# EasyEDA Pro project Esquemático e Layout - Shield Display.eprj

# Schematic Schematic1
Board Name: Board1; Create Date: 2025-09-02; Page Name: P1; Project Name: ShieldDisplay; Schematic Name: Schematic1; Update Date: 2026-02-06; Page Size: A4; Version: V1.0
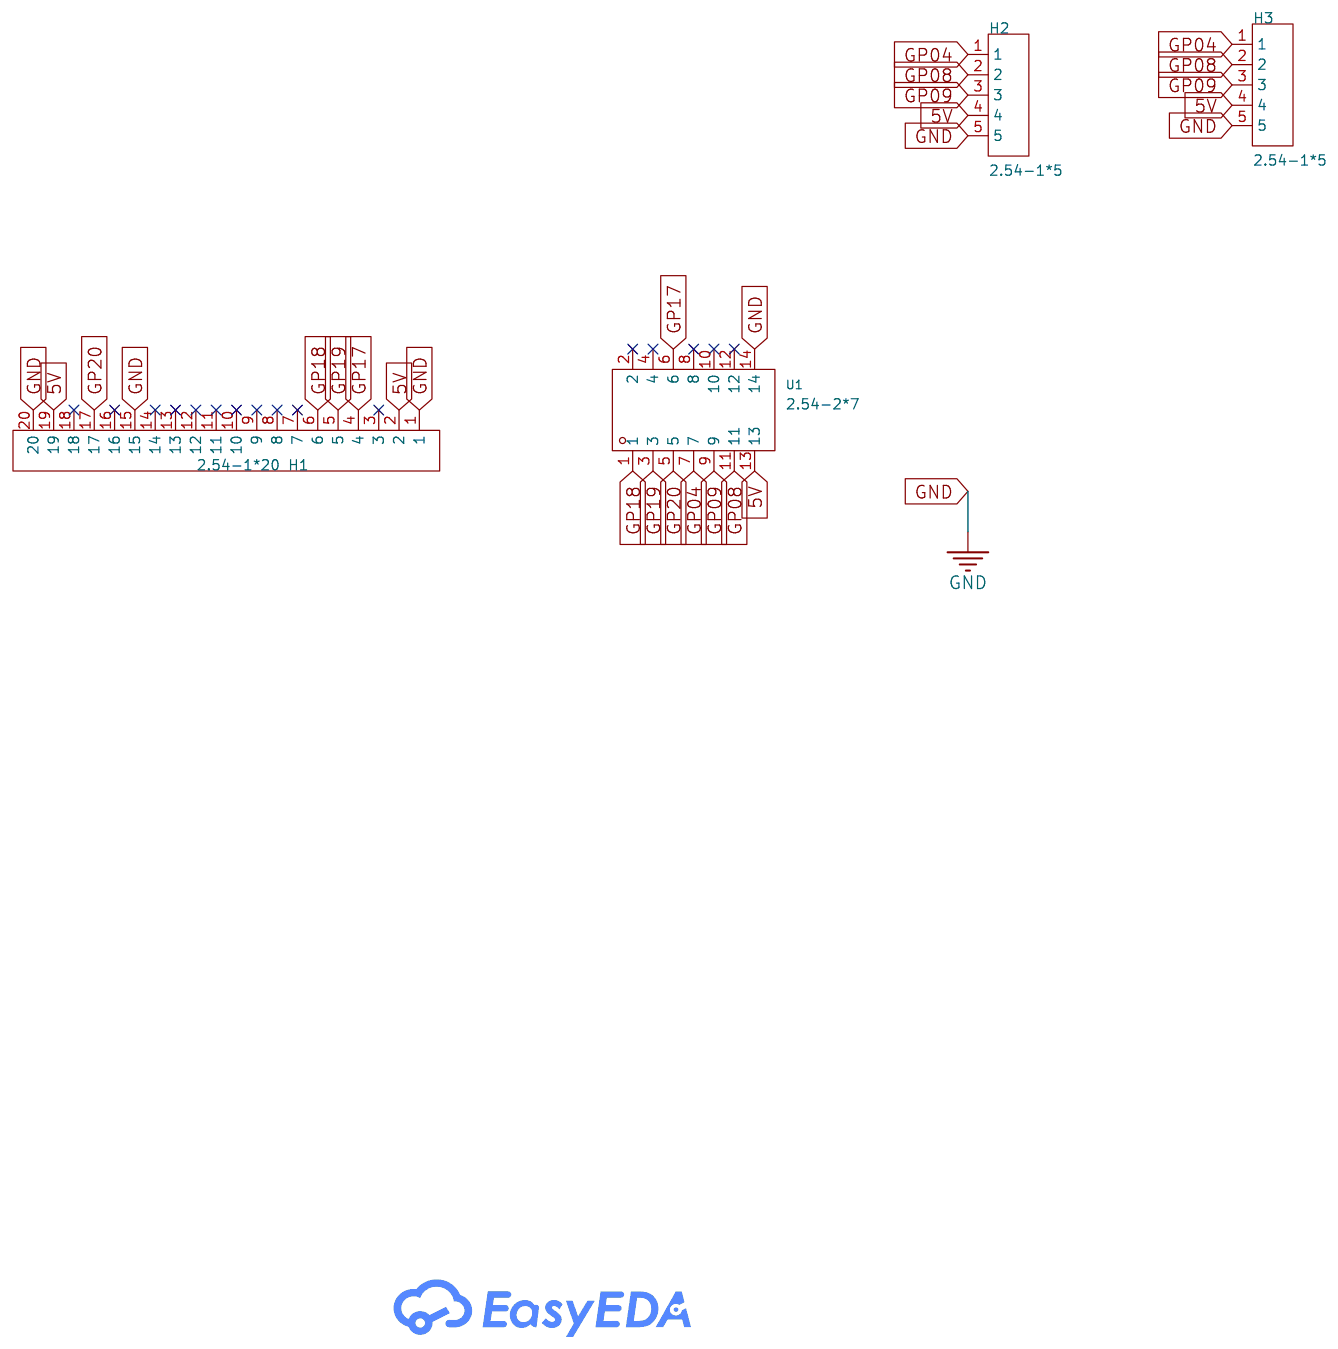
[diagram p0: schematic sheet]

## Parts
H1  2.54-1*20  [HDR-TH_20P-P2.54-V-M]
H2  2.54-1*5  [HDR-TH_5P-P2.54-V-M]
H3  2.54-1*5  [HDR-TH_5P-P2.54-V-M]
U1  2.54-2*7  [HDR-TH_14P-P2.54-V-F-R2-C7-S2.54]

## Library data of the parts
H1 = 2.54-1*20: Pin Structure:1x20P Pitch:2.54mm Number of Rows:1 Number of Pins:20P; Supplier Part: C5156618; Manufacturer: ZHOURI(洲日); Supplier Footprint: 插件,P=2.54mm; JLCPCB Part Class: Extended Part; Datasheet: https://item.szlcsc.com/datasheet/2.54-1*20/5790718.html; Supplier: LCSC; Pin Structure: 1x20P; Pitch: 2.54mm; Number of Rows: 1; Number of Pins: 20P
H2 H3 = 2.54-1*5: Pin Structure:1x5P Pitch:2.54mm Number of Rows:1 Number of Pins:5P; Supplier Part: C5156614; Manufacturer: ZHOURI(洲日); Supplier Footprint: 插件,P=2.54mm; JLCPCB Part Class: Extended Part; Datasheet: https://item.szlcsc.com/datasheet/2.54-1*5/5790714.html; Supplier: LCSC; Pin Structure: 1x5P; Pitch: 2.54mm; Number of Rows: 1; Number of Pins: 5P
U1 = 2.54-2*7: Pin Structure:2x7P Pitch:2.54mm Number of Rows:2 Number of Pins:14P; Supplier Part: C5116484; Manufacturer: ZHOURI(洲日); Supplier Footprint: 插件,P=2.54mm; JLCPCB Part Class: Extended Part; Datasheet: https://item.szlcsc.com/datasheet/2.54-2*7/5692727.html; Supplier: LCSC; Pin Structure: 2x7P; Pitch: 2.54mm; Number of Rows: 2; Number of Pins: 14P

## Nets
5V: H1.2 H1.19 H2.4 H3.4 U1.13
GND: H1.1 H1.15 H1.20 H2.5 H3.5 U1.14
GP04: H2.1 H3.1 U1.7
GP08: H2.2 H3.2 U1.11
GP09: H2.3 H3.3 U1.9
GP17: H1.4 U1.6
GP18: H1.6 U1.1
GP19: H1.5 U1.3
GP20: H1.17 U1.5

Not connected (* = marked no-connect by the designer): H1 3* 7* 8* 9* 10* 11* 12* 13* 14* 16* 18*; U1 2* 4* 8* 10* 12*

# Board PCB1
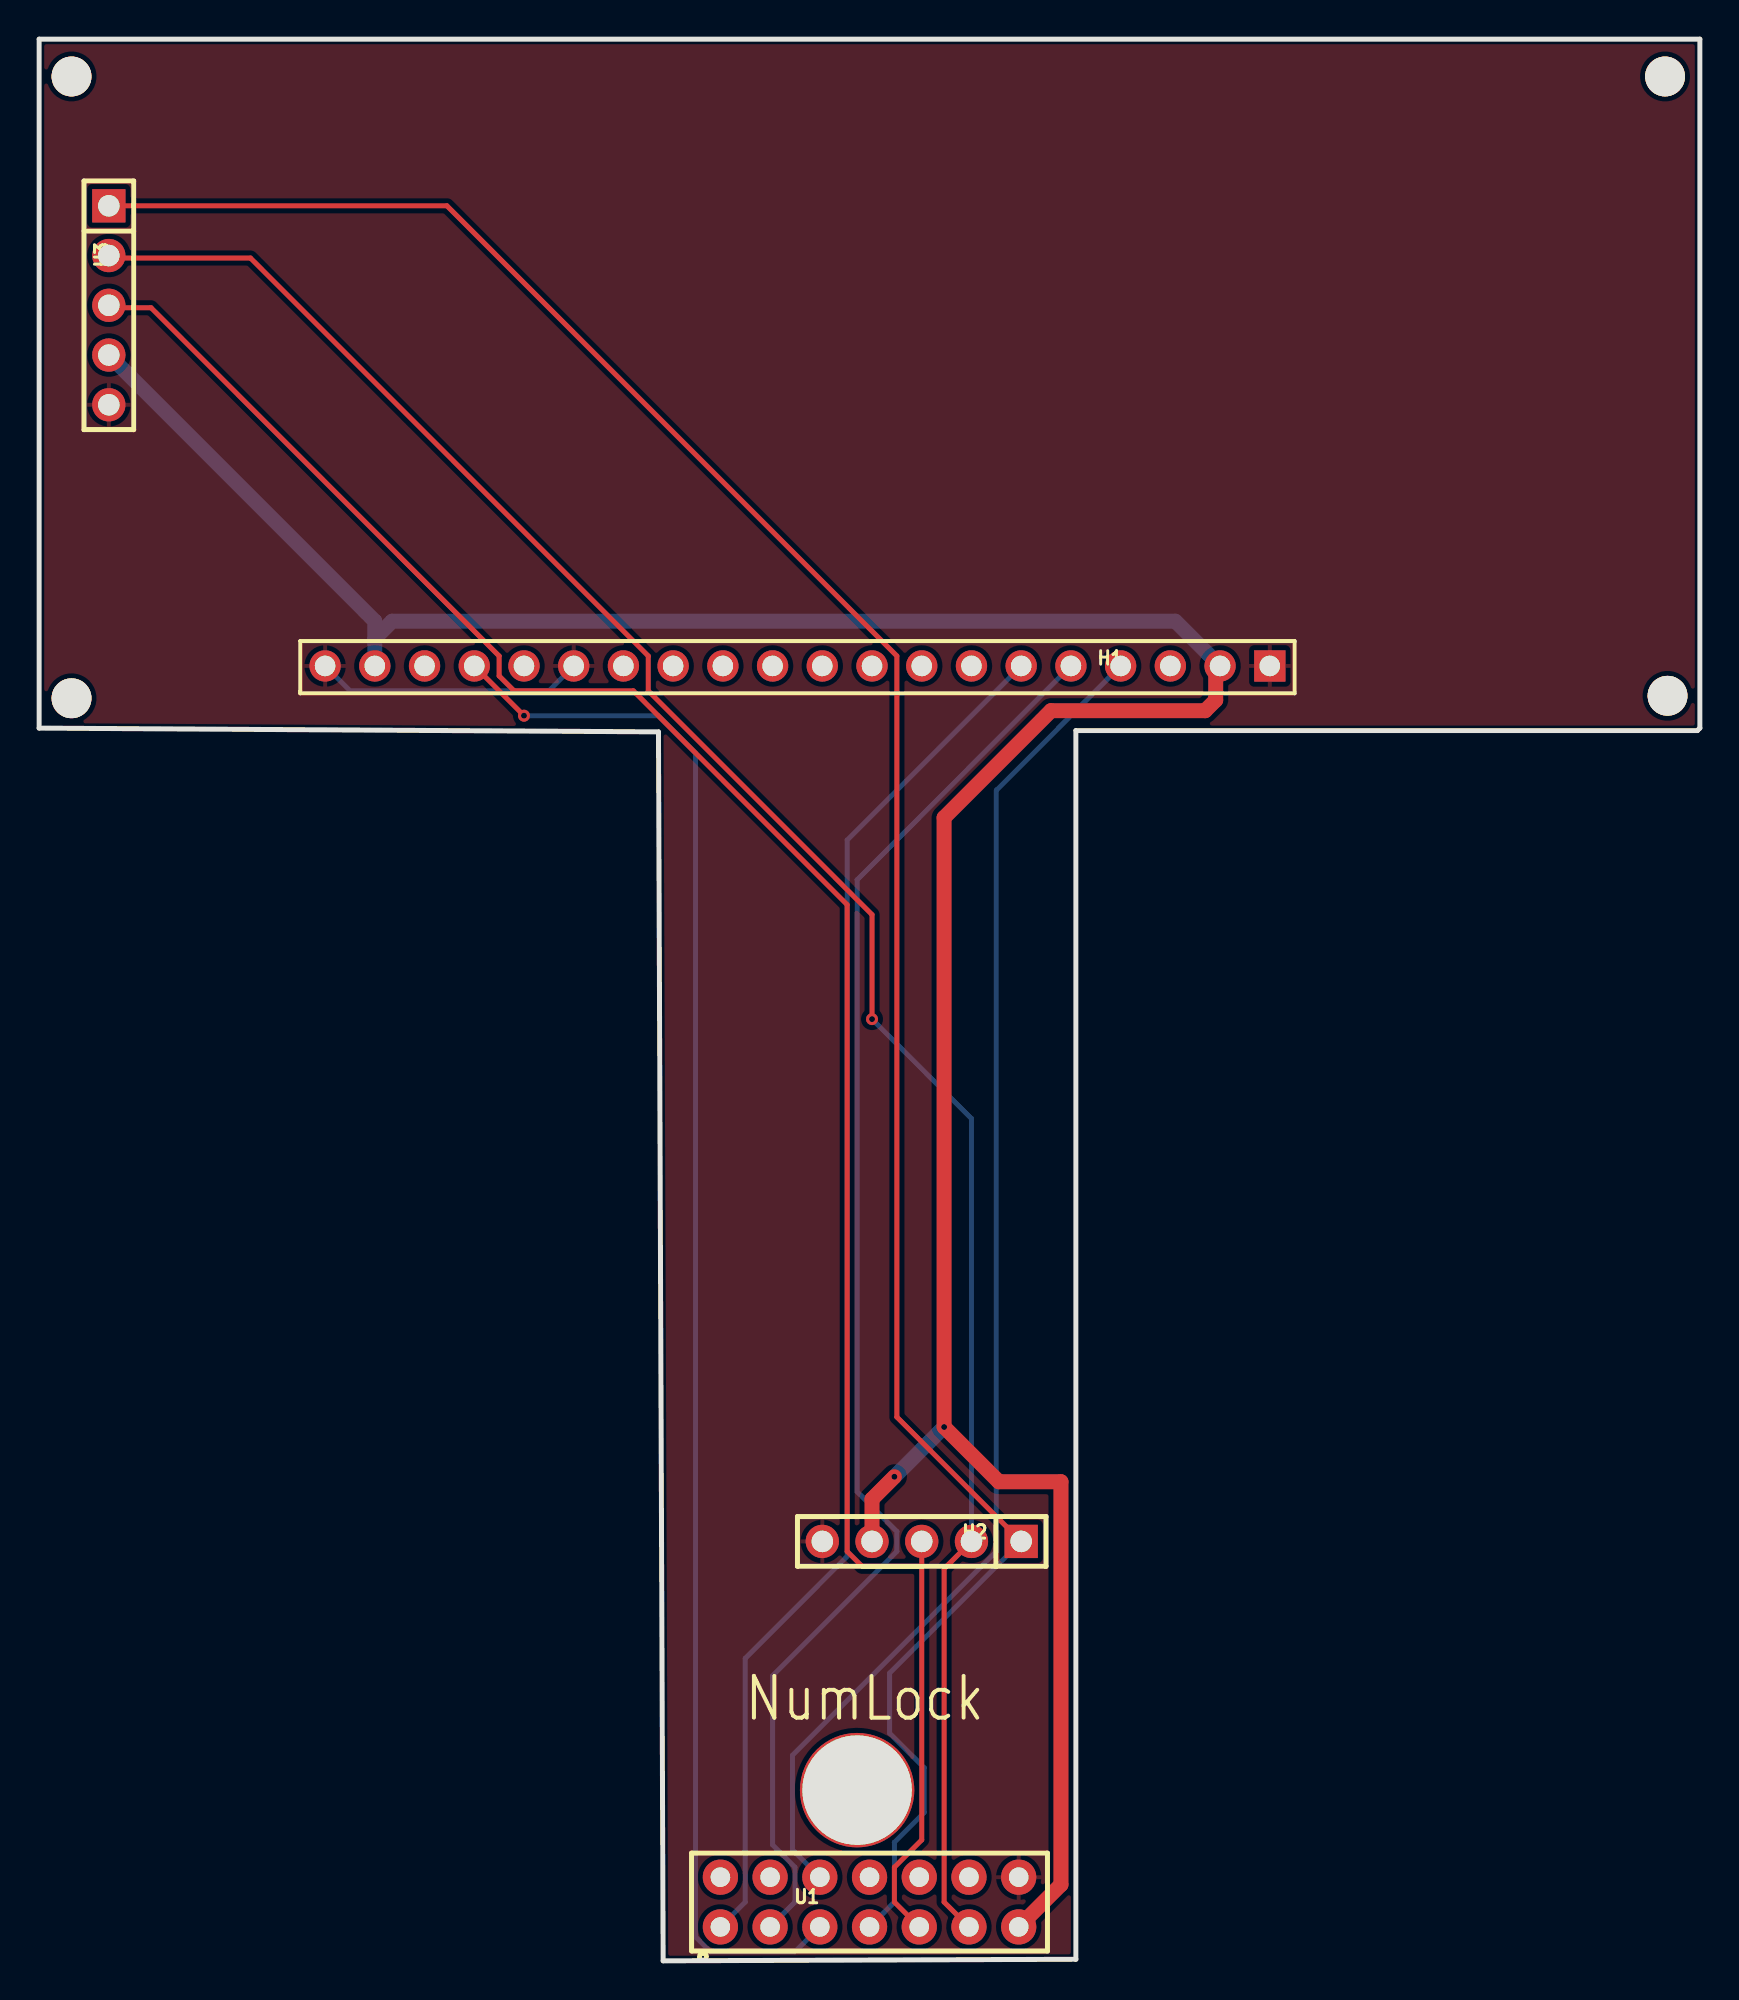
[diagram p1: board, top side]
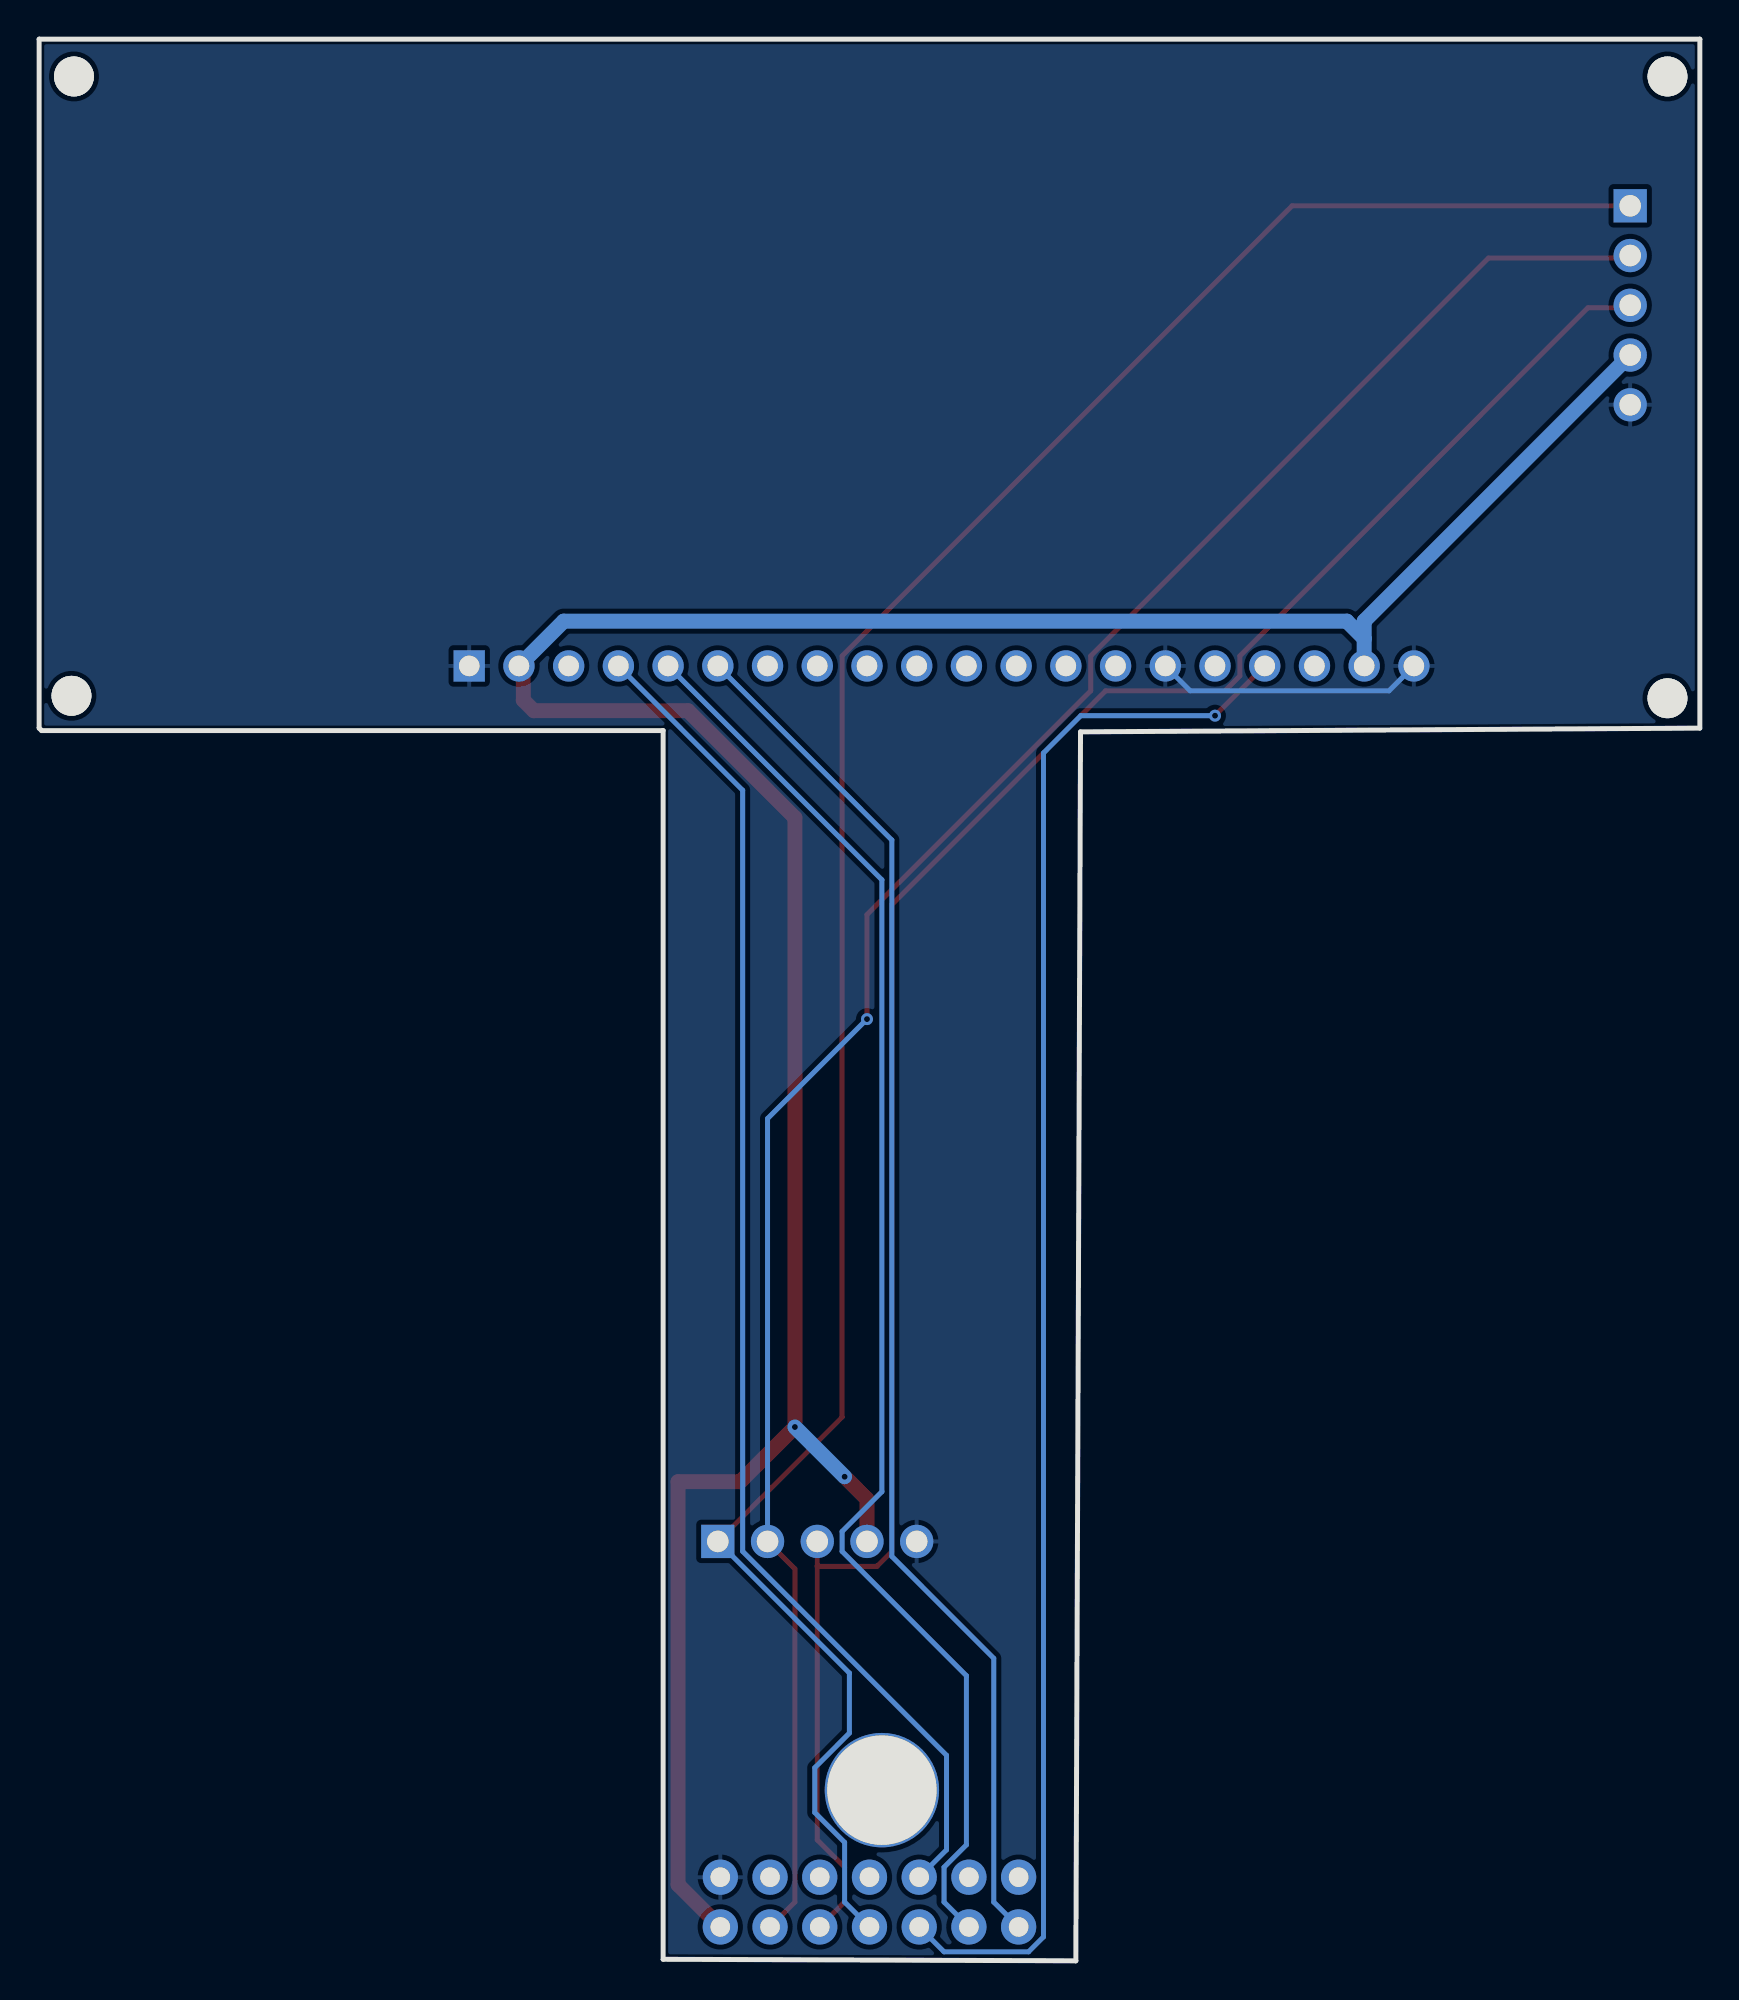
[diagram p2: board, bottom side, seen from below]

Outline 84.84 x 98.12 mm; copper layers: Top Layer, Bottom Layer. Coordinates in mm from the lower left corner of the outline.
Outline path: 0,98.12 0,62.94 31.64,62.75 31.88,0 52.96,0.08 52.96,62.82 84.71,62.82 84.84,62.94 84.84,98.12 0,98.12
Stack: Top Layer 0.035mm / Dielectric1 1.51mm FR4 er 4.5 / Bottom Layer 0.035mm

## Design rules (mm)
template: JLCPCB Capability(Two Layers Board)
spacing copperThickness1oz (default): track to track 0.102, other pairs 0.152 to 0.3
spacing copperThickness2oz: track to track 0.203, other pairs 0.152 to 0.3
track width copperThickness1oz (default): min 0.127, default 0.254, max 2.54
track width copperThickness2oz: min 0.203, default 0.254, max 2.54
differential pair differentialPair (default): width min 0.127, default 0.254, max 2.54; gap min 0.152, default 0.152
via viaSize (default): diameter min 0.5, default 0.61, max 10; hole min 0.3, default 0.305, max 6.3

## Placement (name value [footprint] x y rotation side)
H1  2.54-1*20  [HDR-TH_20P-P2.54-V-M]  38.74 66.12 180 top
H2  2.54-1*5  [HDR-TH_5P-P2.54-V-M]  45.09 21.42 180 top
H3  2.54-1*5  [HDR-TH_5P-P2.54-V-M]  3.56 84.53 270 top
NOREF  -  [Pad_e5]  83.19 64.6 0 top
NOREF#2  -  [Pad_e48]  41.79 8.72 0 top
NOREF#3  -  [Pad_e7]  1.65 96.22 0 top
NOREF#4  -  [Pad_e6]  83.06 96.22 0 top
NOREF#5  -  [Pad_e45]  1.65 64.47 0 top
U1  2.54-2*7  [HDR-TH_14P-P2.54-V-F-R2-C7-S2.54]  42.42 3 0 top

## Footprints (pads in the part's own frame, mm; a bottom-side part is the same pattern mirrored in y, then rotated)
HDR-TH_5P-P2.54-V-M
  rect 1.7x1.7 hole 1.1: 1(-5.08,0)
  round 1.7 hole 1.1: 2(-2.54,0) 3(0,0) 4(2.54,0) 5(5.08,0)
HDR-TH_14P-P2.54-V-F-R2-C7-S2.54
  round 1.8 hole 1: 1(-7.62,-1.27) 2(-7.62,1.27) 3(-5.08,-1.27) 4(-5.08,1.27) 5(-2.54,-1.27) 6(-2.54,1.27) 7(0,-1.27) 8(0,1.27) 9(2.54,-1.27) 10(2.54,1.27) 11(5.08,-1.27) 12(5.08,1.27) 13(7.62,-1.27) 14(7.62,1.27)
HDR-TH_20P-P2.54-V-M
  rect 1.6x1.6 hole 1.05: 1(-24.13,0)
  round 1.6 hole 1.05: 2(-21.59,0) 3(-19.05,0) 4(-16.51,0) 5(-13.97,0) 6(-11.43,0) 7(-8.89,0) 8(-6.35,0) 9(-3.81,0) 10(-1.27,0) 11(1.27,0) 12(3.81,0) 13(6.35,0) 14(8.89,0) 15(11.43,0) 16(13.97,0) 17(16.51,0) 18(19.05,0) 19(21.59,0) 20(24.13,0)
Pad_e5
  round 2.032 hole 2.032: 1(0,0)
Pad_e6
  round 2.032 hole 2.032: 1(0,0)
Pad_e7
  round 2.032 hole 2.032: 1(0,0)
Pad_e45
  round 2.032 hole 2.032: 1(0,0)
Pad_e48
  round 5.842 hole 5.588: 1(0,0)

## Nets
As in the schematic.

Pads without a net: H1 3 7 8 9 10 11 12 13 14 16 18; NOREF 1; NOREF#2 1; NOREF#3 1; NOREF#4 1; NOREF#5 1; U1 2 4 8 10 12

## Via types
v1: diameter 0.61, hole 0.305, Top Layer to Bottom Layer, 4 vias

## Routing (per net, layer and track width the routed paths; a pad name or vN(x,y) marks a point on that pad's centre or on a via; arc(x,y) is an arc through that point)
5V: length 153.4
  Top Layer w0.762: H1.2 60.1,65.9 60.1,64.37 59.57,63.83 51.69,63.83 46.23,58.37 v1(46.23,27.26) 49.02,24.46 52.2,24.46 52.2,3.89 U1.13 ; v1(43.69,24.72) 42.55,23.57 H2.4
  Bottom Layer w0.762: H1.2 58.04,68.41 18.04,68.41 17.15,67.52 ; H3.4 17.15,68.41 17.15,67.52 ; 17.15,67.52 H1.19 ; v1(46.23,27.26) v1(43.69,24.72)
GND: length 13.8
  Bottom Layer w0.254: H1.20 15.88,64.85 26.04,64.85 H1.15
GP04: length 122
  Top Layer w0.254: H3.1 20.83,89.61 43.82,66.63 43.82,27.77 H2.1
  Bottom Layer w0.254: U1.7 43.69,3 43.69,6.05 45.21,7.57 45.21,9.86 43.45,11.63 43.45,14.69 H2.1
GP08: length 108.9
  Top Layer w0.254: U1.11 46.23,3 46.23,20.02 H2.2 ; v1(42.55,48.09) 42.55,53.42 31.12,64.85 31.12,66.63 10.8,86.95 3.69,86.95 H3.2
  Bottom Layer w0.254: v1(42.55,48.09) 47.63,43.01 H2.2
GP09: length 108.9
  Top Layer w0.254: H3.3 3.69,84.41 5.72,84.41 23.5,66.63 23.5,65.61 24.26,64.85 30.36,64.85 41.28,53.93 41.28,20.91 42.04,20.15 45.09,20.15 ; 45.09,20.15 45.09,6.18 43.69,4.78 43.69,3 U1.9 ; 45.09,20.15 H2.3
GP17: length 69.4
  Bottom Layer w0.254: U1.6 38.48,5.67 38.48,10.49 48.9,20.91 48.9,59.77 H1.4
GP18: length 70.8
  Bottom Layer w0.254: H1.6 41.28,57.23 41.28,20.65 36.07,15.45 36.07,3 U1.1
GP19: length 73.4
  Bottom Layer w0.254: H1.5 41.79,55.2 41.79,23.96 43.82,21.92 43.82,20.91 37.47,14.56 37.47,5.92 38.61,4.78 38.61,3 U1.3
GP20: length 80.8
  Top Layer w0.254: 22.23,66.12 v1(24.77,63.58)
  Bottom Layer w0.254: U1.5 38.61,0.46 34.29,0.46 33.53,1.22 33.53,61.67 31.63,63.58 v1(24.77,63.58)

## Copper pours and planes (outline as drawn; the poured copper is in the pictures)
GND on Top Layer: -7.74,107.14 92.46,107.14 92.46,-16.94 -7.74,-16.94
GND on Bottom Layer: -14.09,123.02 91.44,123.02 91.44,-15.54 -14.09,-15.54

## Text on the board
Top Silkscreen Layer: NumLock
